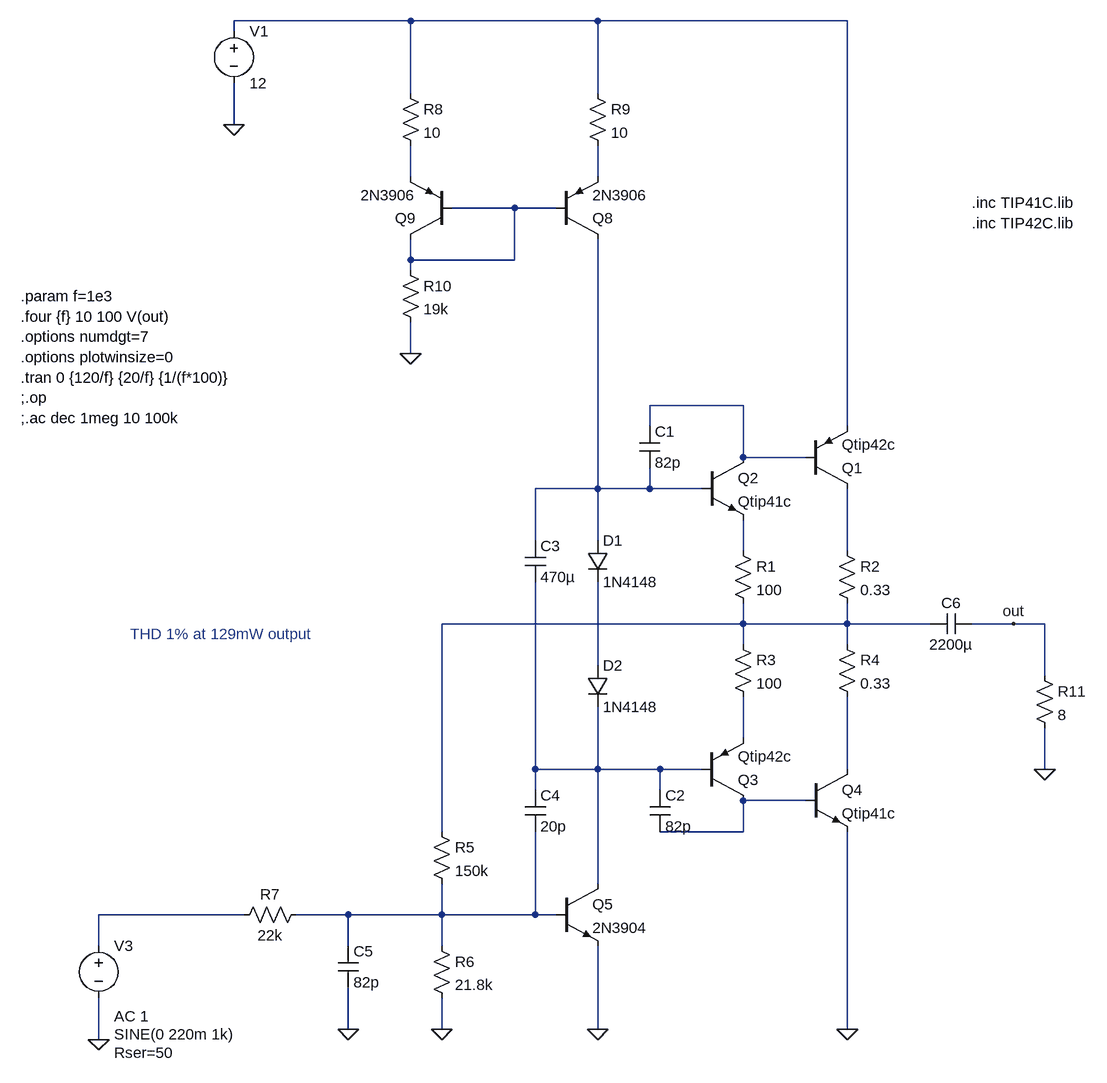
[diagram p0: schematic Wattnik_diyAudio_12V.asc]
Wattnik_diyAudio_12V.asc, the LTspice schematic file:
Version 4
SHEET 1 880 1060
WIRE -400 -544 -672 -544
WIRE -112 -544 -400 -544
WIRE 272 -544 -112 -544
WIRE -672 -528 -672 -544
WIRE -400 -432 -400 -544
WIRE -112 -432 -112 -544
WIRE -672 -384 -672 -448
WIRE -400 -304 -400 -352
WIRE -112 -304 -112 -352
WIRE -240 -256 -336 -256
WIRE -176 -256 -240 -256
WIRE -400 -176 -400 -208
WIRE -240 -176 -240 -256
WIRE -240 -176 -400 -176
WIRE -400 -160 -400 -176
WIRE -400 -32 -400 -80
WIRE 112 48 -32 48
WIRE -32 80 -32 48
WIRE 272 80 272 -544
WIRE 112 128 112 48
WIRE 208 128 112 128
WIRE -112 176 -112 -208
WIRE -112 176 -208 176
WIRE -32 176 -32 144
WIRE -32 176 -112 176
WIRE 48 176 -32 176
WIRE -208 256 -208 176
WIRE -112 256 -112 176
WIRE 112 272 112 224
WIRE 272 272 272 176
WIRE 112 384 112 352
WIRE 112 384 -352 384
WIRE 272 384 272 352
WIRE 272 384 112 384
WIRE 400 384 272 384
WIRE 528 384 464 384
WIRE 576 384 528 384
WIRE 112 416 112 384
WIRE 272 416 272 384
WIRE -112 448 -112 320
WIRE 576 464 576 384
WIRE 112 560 112 496
WIRE -208 608 -208 320
WIRE -112 608 -112 512
WIRE -112 608 -208 608
WIRE -16 608 -112 608
WIRE 48 608 -16 608
WIRE 272 608 272 496
WIRE 576 608 576 544
WIRE -208 640 -208 608
WIRE -16 640 -16 608
WIRE 208 656 112 656
WIRE -352 704 -352 384
WIRE 112 704 112 656
WIRE 112 704 -16 704
WIRE -112 784 -112 608
WIRE -656 832 -880 832
WIRE -496 832 -576 832
WIRE -352 832 -352 784
WIRE -352 832 -496 832
WIRE -208 832 -208 704
WIRE -208 832 -352 832
WIRE -176 832 -208 832
WIRE -880 880 -880 832
WIRE -496 880 -496 832
WIRE -352 880 -352 832
WIRE -496 1008 -496 944
WIRE -352 1008 -352 960
WIRE -112 1008 -112 880
WIRE 272 1008 272 704
WIRE -880 1024 -880 960
FLAG -400 -32 0
FLAG 272 1008 0
FLAG -112 1008 0
FLAG -352 1008 0
FLAG -880 1024 0
FLAG -496 1008 0
FLAG -672 -384 0
FLAG 576 608 0
FLAG 528 384 out
SYMBOL pnp 208 176 M180
SYMATTR InstName Q1
SYMATTR Value Qtip42c
SYMBOL npn 48 128 R0
SYMATTR InstName Q2
SYMATTR Value Qtip41c
SYMBOL res 96 256 R0
SYMATTR InstName R1
SYMATTR Value 100
SYMBOL res 256 256 R0
SYMATTR InstName R2
SYMATTR Value 0.33
SYMBOL res 96 400 R0
SYMATTR InstName R3
SYMATTR Value 100
SYMBOL res 256 400 R0
SYMATTR InstName R4
SYMATTR Value 0.33
SYMBOL pnp 48 656 M180
SYMATTR InstName Q3
SYMATTR Value Qtip42c
SYMBOL npn 208 608 R0
SYMATTR InstName Q4
SYMATTR Value Qtip41c
SYMBOL cap -48 80 R0
SYMATTR InstName C1
SYMATTR Value 82p
SYMBOL cap -32 640 R0
SYMATTR InstName C2
SYMATTR Value 82p
SYMBOL diode -128 256 R0
SYMATTR InstName D1
SYMATTR Value 1N4148
SYMBOL diode -128 448 R0
SYMATTR InstName D2
SYMATTR Value 1N4148
SYMBOL cap -224 256 R0
SYMATTR InstName C3
SYMATTR Value 470µ
SYMBOL cap -224 640 R0
SYMATTR InstName C4
SYMATTR Value 20p
SYMBOL npn -176 784 R0
SYMATTR InstName Q5
SYMATTR Value 2N3904
SYMBOL res -368 688 R0
SYMATTR InstName R5
SYMATTR Value 150k
SYMBOL res -368 864 R0
SYMATTR InstName R6
SYMATTR Value 21.8k
SYMBOL cap -512 880 R0
SYMATTR InstName C5
SYMATTR Value 82p
SYMBOL res -560 816 R90
WINDOW 0 0 56 VBottom 2
WINDOW 3 32 56 VTop 2
SYMATTR InstName R7
SYMATTR Value 22k
SYMBOL pnp -176 -208 M180
SYMATTR InstName Q8
SYMATTR Value 2N3906
SYMBOL pnp -336 -208 R180
SYMATTR InstName Q9
SYMATTR Value 2N3906
SYMBOL res -416 -448 R0
SYMATTR InstName R8
SYMATTR Value 10
SYMBOL res -128 -448 R0
SYMATTR InstName R9
SYMATTR Value 10
SYMBOL res -416 -176 R0
SYMATTR InstName R10
SYMATTR Value 19k
SYMBOL voltage -672 -544 R0
SYMATTR InstName V1
SYMATTR Value 12
SYMBOL voltage -880 864 R0
WINDOW 3 24 152 Left 2
WINDOW 123 24 124 Left 2
WINDOW 39 24 180 Left 2
SYMATTR Value SINE(0 220m 1k)
SYMATTR Value2 AC 1
SYMATTR SpiceLine Rser=50
SYMATTR InstName V3
SYMBOL cap 464 368 R90
WINDOW 0 0 32 VBottom 2
WINDOW 3 32 32 VTop 2
SYMATTR InstName C6
SYMATTR Value 2200µ
SYMBOL res 560 448 R0
SYMATTR InstName R11
SYMATTR Value 8
TEXT 464 -264 Left 2 !.inc TIP41C.lib\n.inc TIP42C.lib
TEXT -1000 -120 Left 2 !.param f=1e3\n.four {f} 10 100 V(out)\n.options numdgt=7\n.options plotwinsize=0\n.tran 0 {120/f} {20/f} {1/(f*100)}\n;.op\n;.ac dec 1meg 10 100k
TEXT -832 400 Left 2 ;THD 1% at 129mW output

The netlist it stands for:
* Wattnik_diyAudio_12V.asc
Q1 N008 N005 N001 0 Qtip42c
Q2 N005 N006 N007 0 Qtip41c
R1 N007 N009 100
R2 N008 N009 0.33
R3 N009 N011 100
R4 N009 N013 0.33
Q3 N014 N012 N011 0 Qtip42c
Q4 N013 N014 0 0 Qtip41c
C1 N005 N006 82p
C2 N012 N014 82p
D1 N006 N010 1N4148
D2 N010 N012 1N4148
C3 N006 N012 470µ
C4 N012 N016 20p
Q5 N012 N016 0 0 2N3904
R5 N009 N016 150k
R6 N016 0 21.8k
C5 N016 0 82p
R7 N016 N015 22k
Q8 N006 N004 N003 0 2N3906
Q9 N004 N004 N002 0 2N3906
R8 N001 N002 10
R9 N001 N003 10
R10 N004 0 19k
V1 N001 0 12
V3 N015 0 SINE(0 220m 1k) AC 1 Rser=50
C6 out N009 2200µ
R11 out 0 8
.model D D
.lib standard.dio
.model NPN NPN
.model PNP PNP
.lib standard.bjt
.inc TIP41C.lib
.inc TIP42C.lib
.param f=1e3
.four {f} 10 100 V(out)
.options numdgt=7
.options plotwinsize=0
.tran 0 {120/f} {20/f} {1/(f*100)}
;.op
;.ac dec 1meg 10 100k
* THD 1% at 129mW output
.backanno
.end